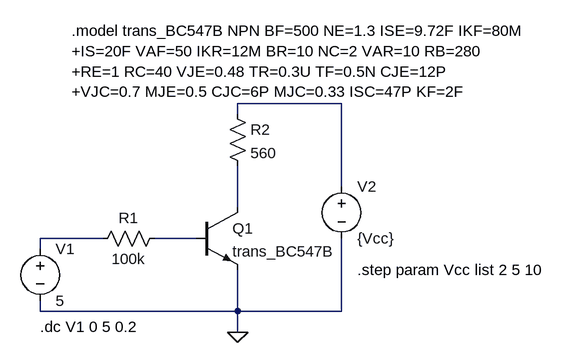
[diagram p0: schematic beta(fig8).asc]
beta(fig8).asc, the LTspice schematic file:
Version 4.1
SHEET 1 2620 680
WIRE 448 -80 288 -80
WIRE 288 -64 288 -80
WIRE 448 48 448 -80
WIRE 288 80 288 16
WIRE 80 128 -16 128
WIRE 224 128 160 128
WIRE -16 144 -16 128
WIRE -16 240 -16 224
WIRE 288 240 288 176
WIRE 288 240 -16 240
WIRE 448 240 448 128
WIRE 448 240 288 240
WIRE 288 272 288 240
FLAG 288 272 0
SYMBOL voltage -16 128 R0
WINDOW 123 0 0 Left 0
WINDOW 39 0 0 Left 0
SYMATTR InstName V1
SYMATTR Value 5
SYMBOL res 64 144 R270
WINDOW 0 32 56 VTop 2
WINDOW 3 0 56 VBottom 2
SYMATTR InstName R1
SYMATTR Value 100k
SYMBOL npn 224 80 R0
SYMATTR InstName Q1
SYMATTR Value trans_BC547B
SYMBOL res 272 -80 R0
SYMATTR InstName R2
SYMATTR Value 560
SYMBOL voltage 448 32 R0
WINDOW 123 0 0 Left 0
WINDOW 39 0 0 Left 0
SYMATTR InstName V2
SYMATTR Value {Vcc}
TEXT -16 264 Left 2 !.dc V1 0 5 0.2
TEXT 472 176 Left 2 !.step param Vcc list 2 5 10
TEXT 32 -192 Left 2 !.model trans_BC547B NPN BF=500 NE=1.3 ISE=9.72F IKF=80M\n+IS=20F VAF=50 IKR=12M BR=10 NC=2 VAR=10 RB=280\n+RE=1 RC=40 VJE=0.48 TR=0.3U TF=0.5N CJE=12P\n+VJC=0.7 MJE=0.5 CJC=6P MJC=0.33 ISC=47P KF=2F

The netlist it stands for:
* beta(fig8).asc
V1 N003 0 5
R1 N003 N004 100k
Q1 N002 N004 0 0 trans_BC547B
R2 N001 N002 560
V2 N001 0 {Vcc}
.model NPN NPN
.model PNP PNP
.lib standard.bjt
.dc V1 0 5 0.2
.step param Vcc list 2 5 10
.model trans_BC547B NPN BF=500 NE=1.3 ISE=9.72F IKF=80M
+IS=20F VAF=50 IKR=12M BR=10 NC=2 VAR=10 RB=280
+RE=1 RC=40 VJE=0.48 TR=0.3U TF=0.5N CJE=12P
+VJC=0.7 MJE=0.5 CJC=6P MJC=0.33 ISC=47P KF=2F
.backanno
.end